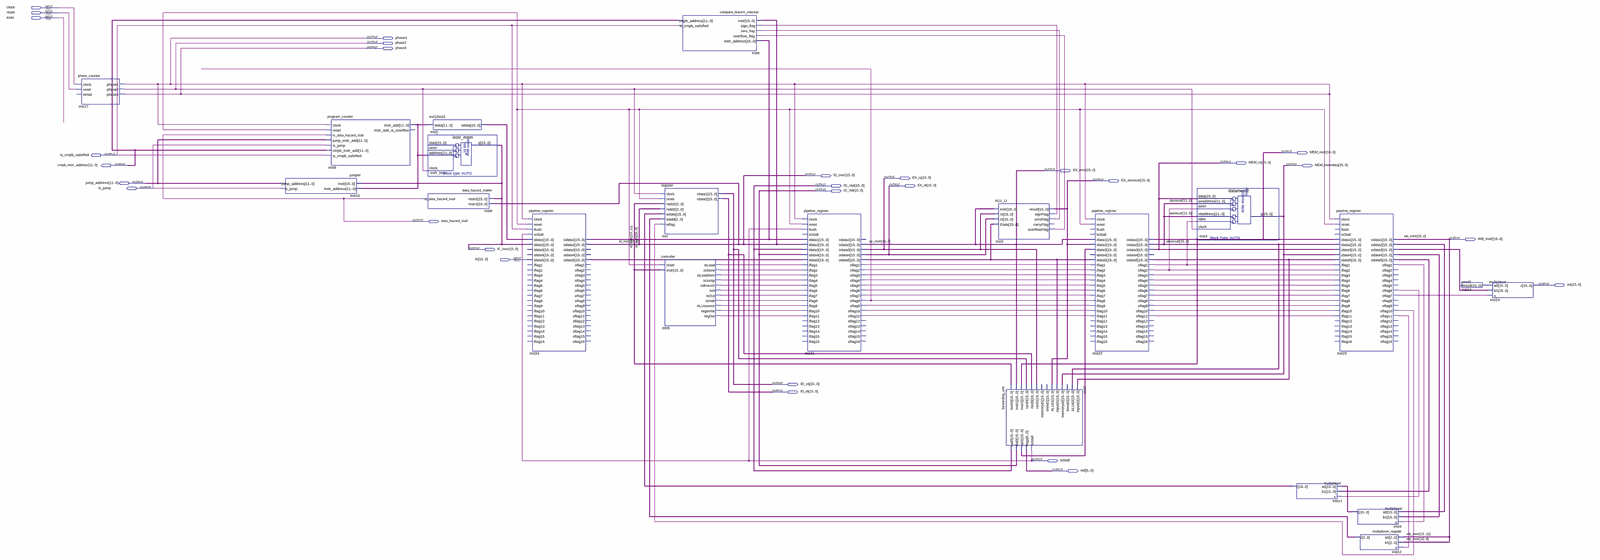
[diagram p0: schematic sheet, whole]
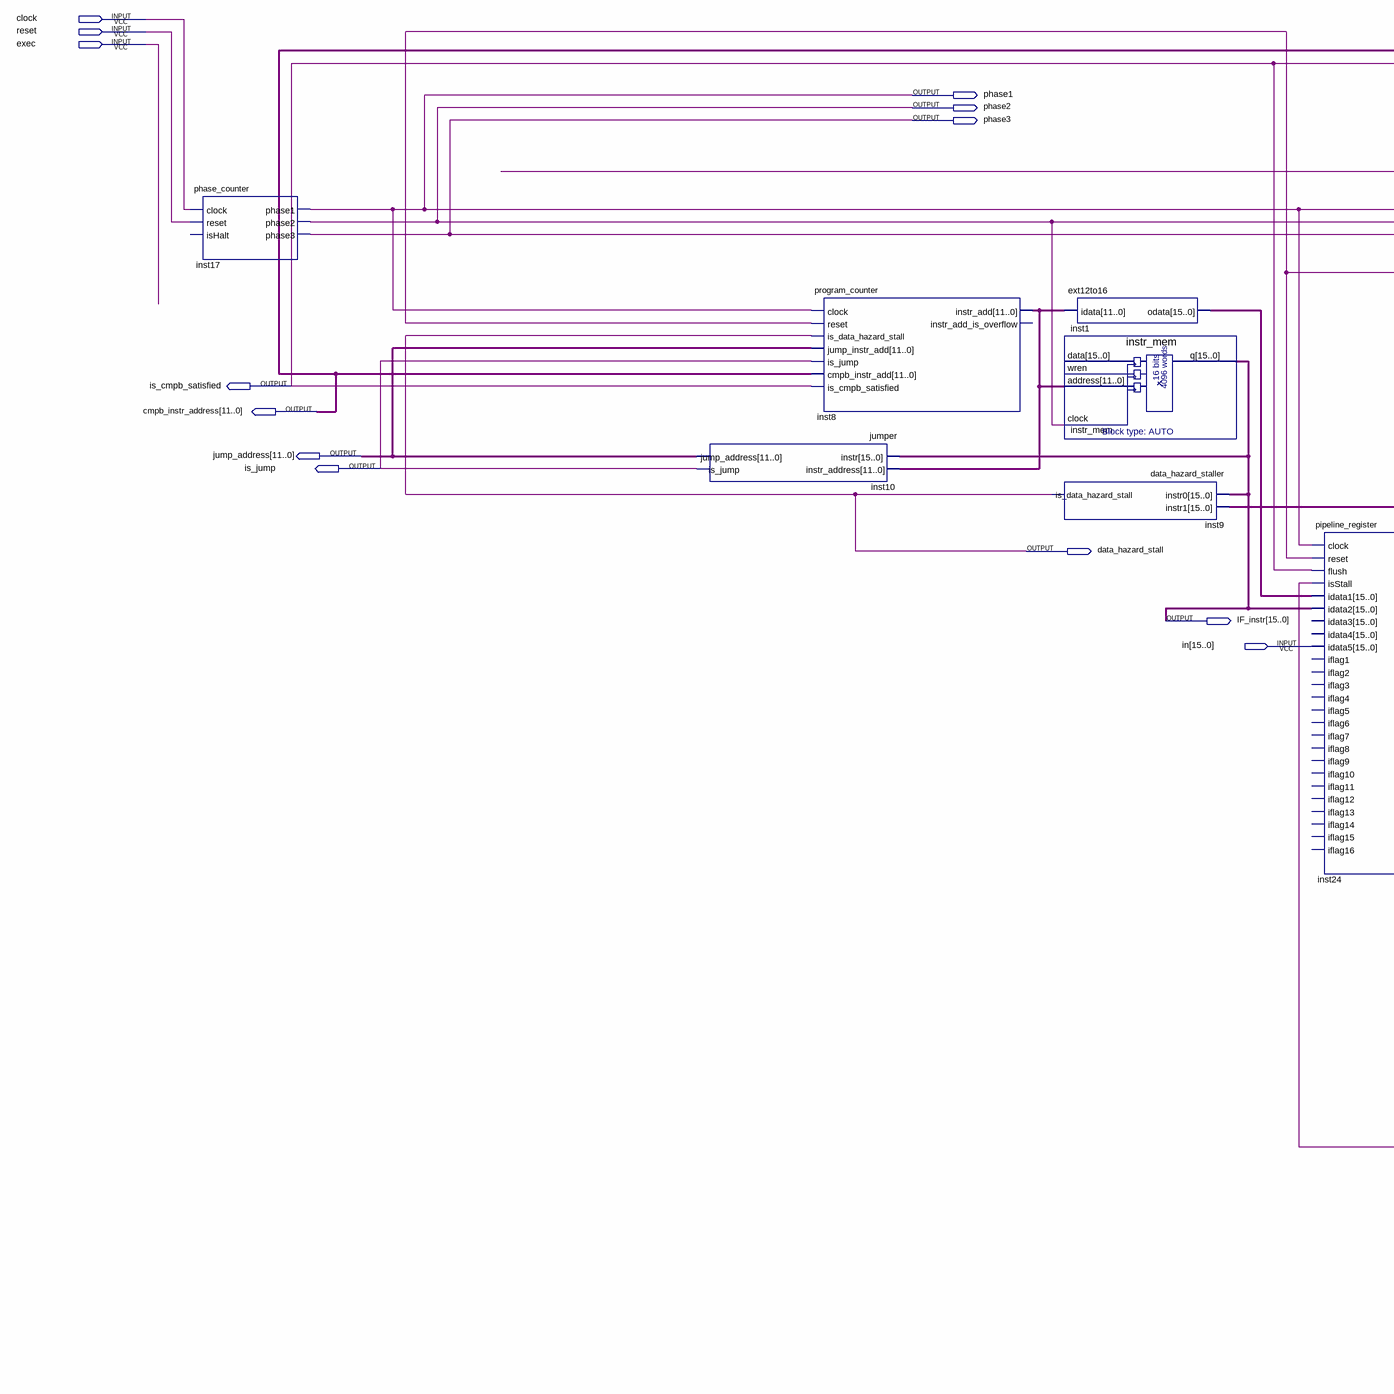
[diagram p1: schematic sheet, left part]
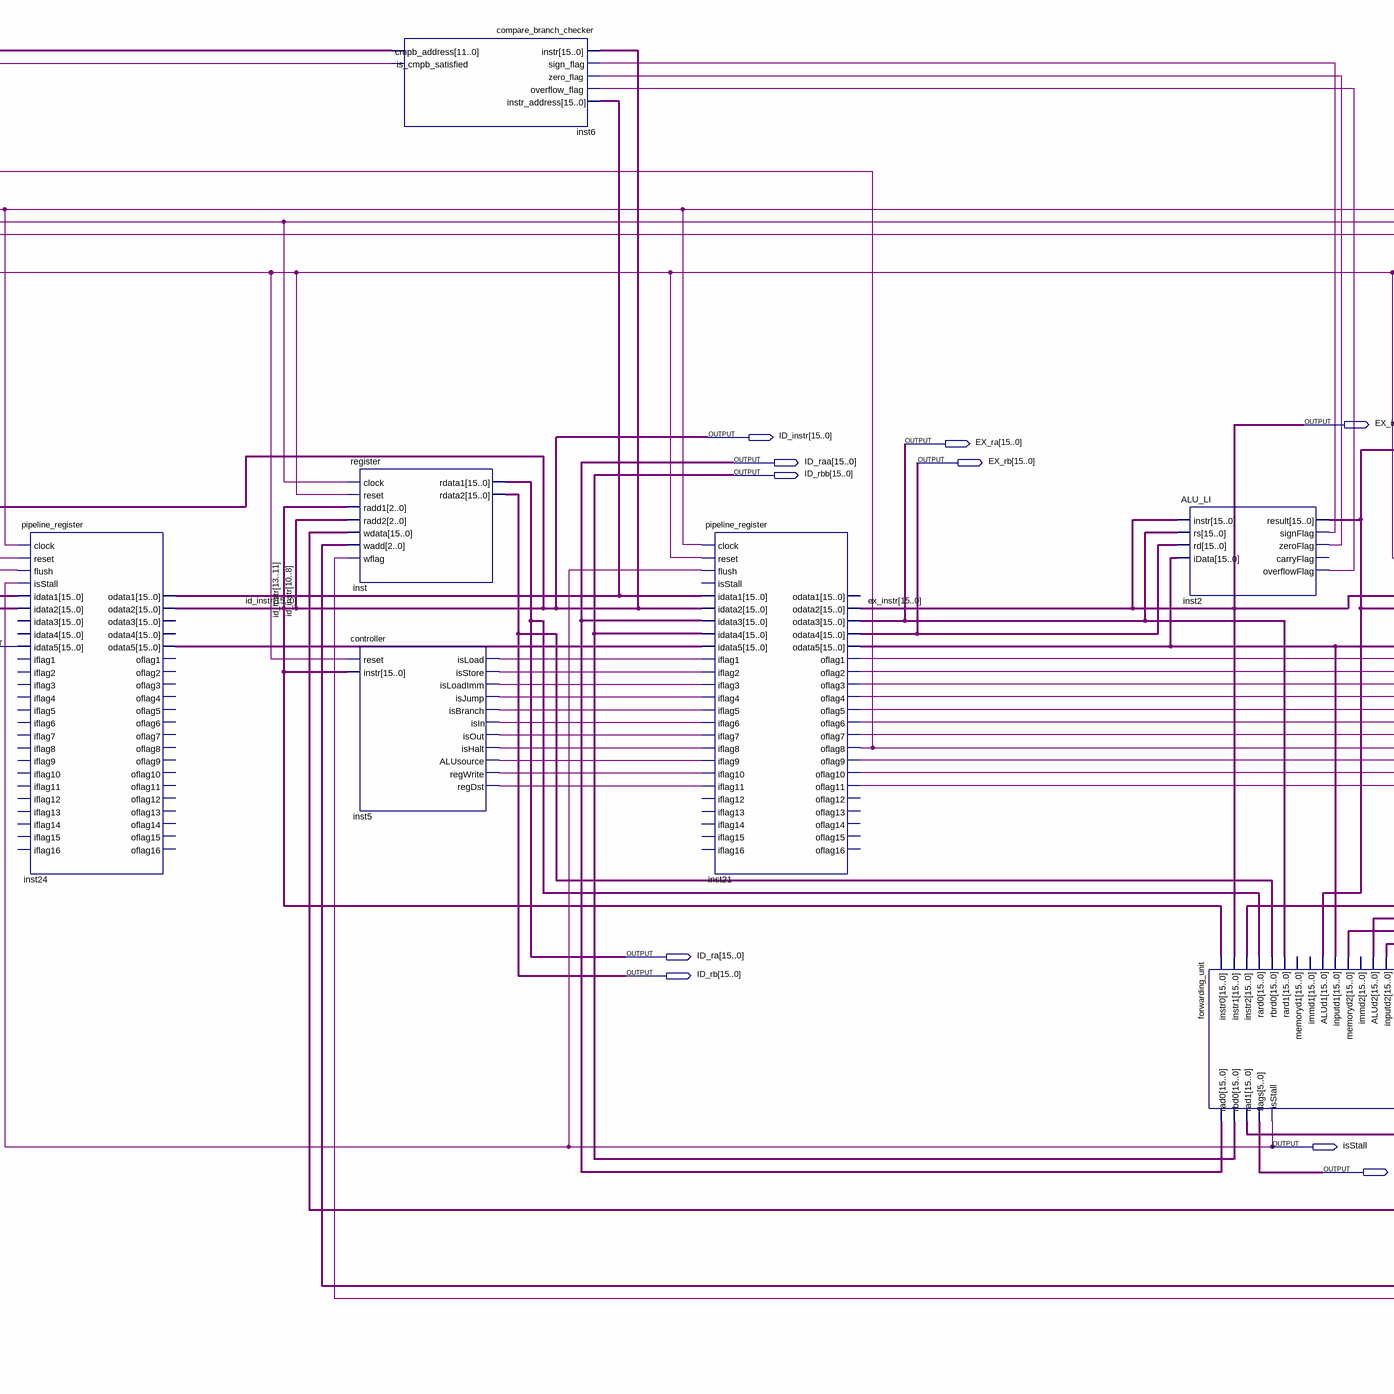
[diagram p2: schematic sheet, centre part]
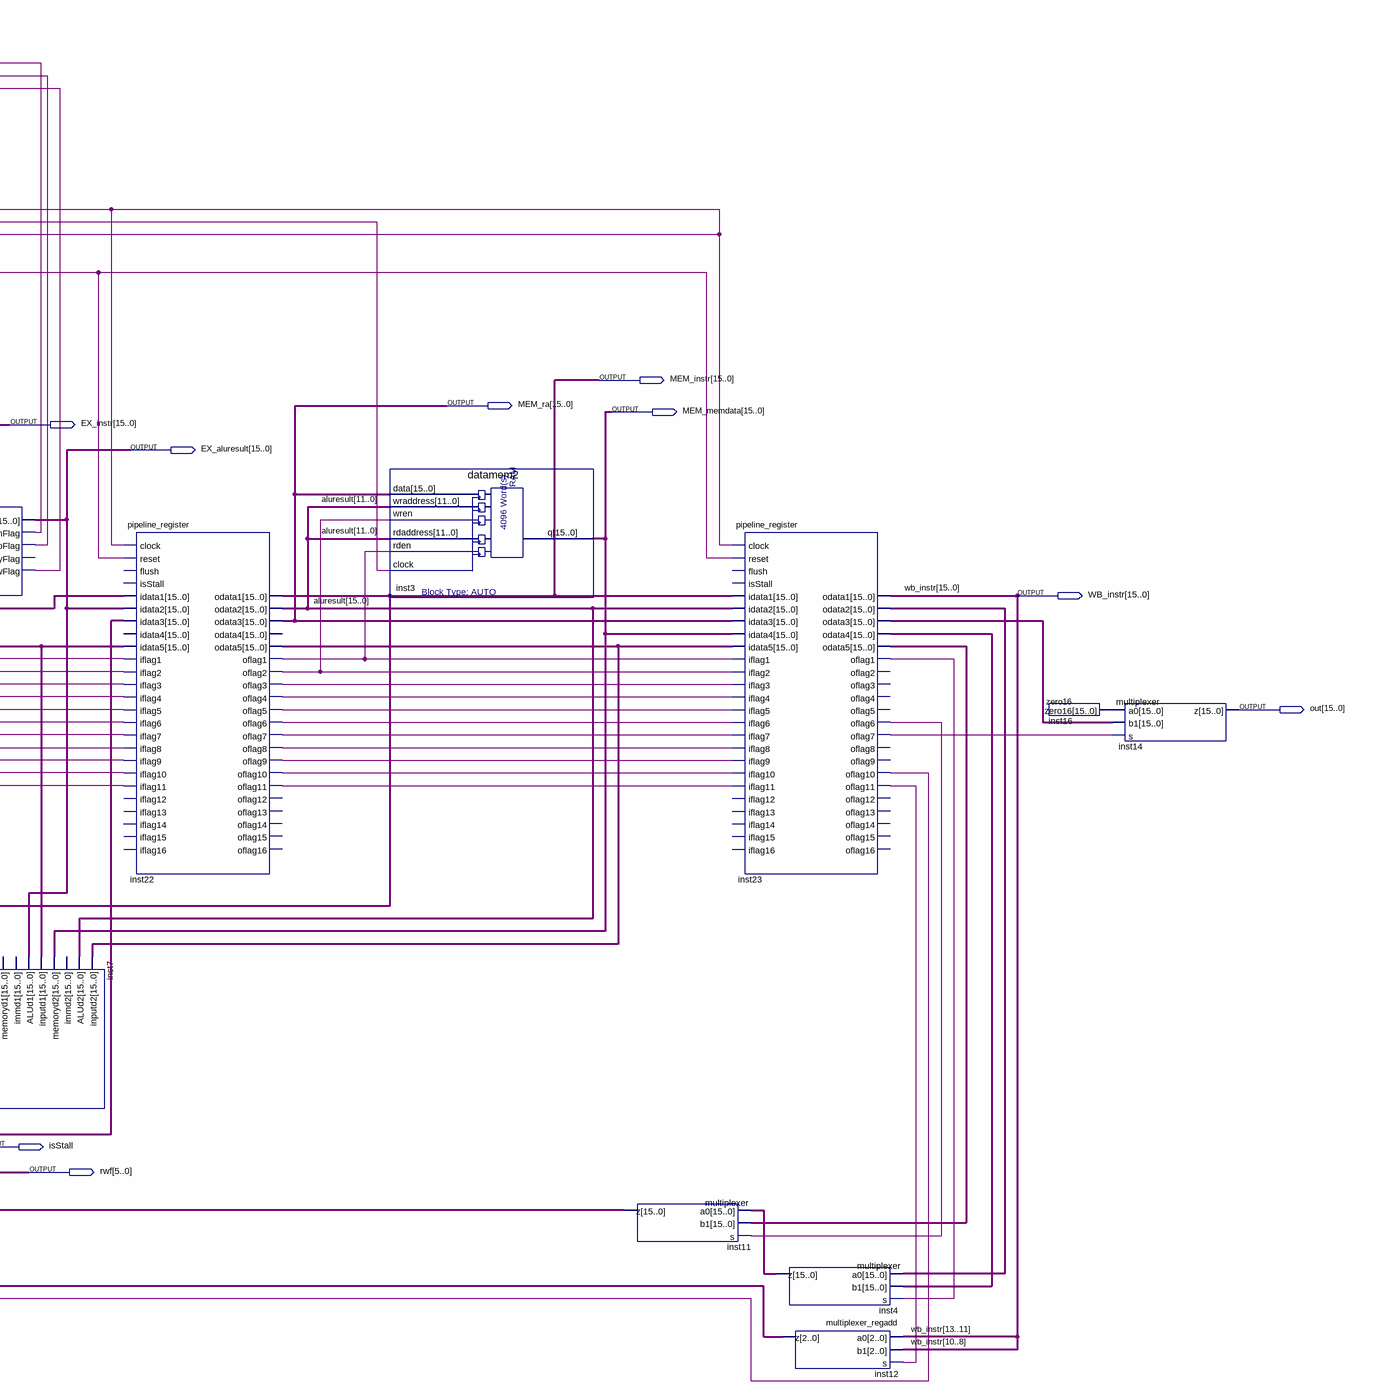
[diagram p3: schematic sheet, right part]
// Quartus schematic top514.bdf as structural Verilog: 21 symbols, 29 pins
module top514 (
  input  clock,
  input  reset,
  input  exec,
  input  [15:0] in,
  output phase1,
  output phase2,
  output phase3,
  output [15:0] MEM_instr,
  output is_cmpb_satisfied,
  output [15:0] MEM_ra,
  output [11:0] cmpb_instr_address,
  output [15:0] MEM_memdata,
  output [15:0] EX_instr,
  output [15:0] ID_instr,
  output [15:0] EX_ra,
  output [15:0] EX_aluresult,
  output [11:0] jump_address,
  output [15:0] ID_raa,
  output [15:0] EX_rb,
  output is_jump,
  output [15:0] ID_rbb,
  output data_hazard_stall,
  output [15:0] WB_instr,
  output [15:0] IF_instr,
  output [15:0] out,
  output [15:0] ID_ra,
  output [15:0] ID_rb,
  output isStall,
  output [5:0] rwf
);

  wire inst2_overflowflag, inst2_signflag, inst2_zeroflag, inst5_alusource, inst5_isbranch, inst5_ishalt,
       inst5_isin, inst5_isjump, inst5_isload, inst5_isloadimm, inst5_isout, inst5_isstore, inst5_regdst,
       inst5_regwrite, inst21_oflag1, inst21_oflag2, inst21_oflag3, inst21_oflag4, inst21_oflag5,
       inst21_oflag6, inst21_oflag7, inst21_oflag8, inst21_oflag9, inst21_oflag10, inst21_oflag11,
       inst22_oflag1, inst22_oflag2, inst22_oflag3, inst22_oflag4, inst22_oflag5, inst22_oflag6,
       inst22_oflag7, inst22_oflag8, inst22_oflag9, inst22_oflag10, inst22_oflag11, inst23_oflag1,
       inst23_oflag6, inst23_oflag7, inst23_oflag10, inst23_oflag11, undriven;
  wire [2:0] inst12_z;
  wire [11:0] inst8_instr_add;
  wire [15:0] aluresult, inst1_odata, inst4_z, inst7_rad1, inst11_z, inst16_zero16, inst21_odata5,
       inst22_odata5, inst23_odata2, inst23_odata3, inst23_odata4, inst23_odata5, inst24_odata1,
       inst24_odata5;

  phase_counter inst17 (
    .clock(clock), .reset(reset), .phase1(phase1), .phase2(phase2), .phase3(phase1));  // open: isHalt
  jumper inst10 (.instr(IF_instr), .instr_address(inst8_instr_add), .jump_address(jump_address), .is_jump(is_jump));
  program_counter inst8 (
    .clock(phase1), .reset(undriven), .is_data_hazard_stall(data_hazard_stall),
    .jump_instr_add(jump_address), .is_jump(is_jump), .cmpb_instr_add(cmpb_instr_address),
    .is_cmpb_satisfied(is_cmpb_satisfied), .instr_add(inst8_instr_add));  // open: instr_add_is_overflow
  ext12to16 inst1 (.idata(inst8_instr_add), .odata(inst1_odata));
  instr_mem instr_mem (.address(inst8_instr_add), .clock(phase2), .q(IF_instr));  // open: data, wren
  data_hazard_staller inst9 (.instr0(IF_instr), .instr1(ID_instr), .is_data_hazard_stall(data_hazard_stall));
  pipeline_register inst24 (
    .clock(phase1), .reset(undriven), .flush(is_cmpb_satisfied), .isStall(isStall), .idata1(inst1_odata),
    .idata2(IF_instr), .idata5(in), .odata1(inst24_odata1), .odata2(ID_instr), .odata5(inst24_odata5));  // open: idata3, idata4, iflag1, iflag2, iflag3, iflag4, iflag5, iflag6, iflag7, iflag8, iflag9, iflag10, iflag11, iflag12, iflag13, iflag14, iflag15, iflag16, odata3, odata4, oflag1, oflag2, oflag3, oflag4, oflag5, oflag6, oflag7, oflag8, oflag9, oflag10, oflag11, oflag12, oflag13, oflag14, oflag15, oflag16
  register inst (
    .clock(phase2), .reset(undriven), .radd1(ID_instr[13:11]), .radd2(ID_instr[10:8]), .wdata(inst11_z),
    .wadd(inst12_z), .wflag(inst23_oflag10), .rdata1(ID_ra), .rdata2(ID_rb));
  controller inst5 (
    .reset(undriven), .instr(ID_instr), .isLoad(inst5_isload), .isStore(inst5_isstore),
    .isLoadImm(inst5_isloadimm), .isJump(inst5_isjump), .isBranch(inst5_isbranch), .isIn(inst5_isin),
    .isOut(inst5_isout), .isHalt(inst5_ishalt), .ALUsource(inst5_alusource), .regWrite(inst5_regwrite),
    .regDst(inst5_regdst));
  compare_branch_checker inst6 (
    .instr(ID_instr), .sign_flag(inst2_signflag), .zero_flag(inst2_zeroflag),
    .overflow_flag(inst2_overflowflag), .instr_address(inst24_odata1), .cmpb_address(cmpb_instr_address),
    .is_cmpb_satisfied(is_cmpb_satisfied));
  pipeline_register inst21 (
    .clock(phase1), .reset(undriven), .flush(isStall), .idata1(inst24_odata1), .idata2(ID_instr),
    .idata3(ID_raa), .idata4(ID_rbb), .idata5(inst24_odata5), .iflag1(inst5_isload), .iflag2(inst5_isstore),
    .iflag3(inst5_isloadimm), .iflag4(inst5_isjump), .iflag5(inst5_isbranch), .iflag6(inst5_isin),
    .iflag7(inst5_isout), .iflag8(inst5_ishalt), .iflag9(inst5_alusource), .iflag10(inst5_regwrite),
    .iflag11(inst5_regdst), .odata2(EX_instr), .odata3(EX_ra), .odata4(EX_rb), .odata5(inst21_odata5),
    .oflag1(inst21_oflag1), .oflag2(inst21_oflag2), .oflag3(inst21_oflag3), .oflag4(inst21_oflag4),
    .oflag5(inst21_oflag5), .oflag6(inst21_oflag6), .oflag7(inst21_oflag7), .oflag8(inst21_oflag8),
    .oflag9(inst21_oflag9), .oflag10(inst21_oflag10), .oflag11(inst21_oflag11));  // open: isStall, iflag12, iflag13, iflag14, iflag15, iflag16, odata1, oflag12, oflag13, oflag14, oflag15, oflag16
  ALU_LI inst2 (
    .instr(EX_instr), .rs(EX_ra), .rd(EX_rb), .iData(inst21_odata5), .result(EX_aluresult),
    .signFlag(inst2_signflag), .zeroFlag(inst2_zeroflag), .overflowFlag(inst2_overflowflag));  // open: carryFlag
  forwarding_unit inst7 (
    .instr0(ID_instr), .instr1(EX_instr), .instr2(MEM_instr), .rard0(ID_ra), .rbrd0(ID_rb), .rard1(EX_ra),
    .ALUd1(EX_aluresult), .inputd1(inst21_odata5), .memoryd2(MEM_memdata), .ALUd2(aluresult),
    .inputd2(inst22_odata5), .rad0(ID_raa), .rbd0(ID_rbb), .rad1(inst7_rad1), .flags(rwf), .isStall(isStall));  // open: memoryd1, immd1, immd2
  pipeline_register inst22 (
    .clock(phase1), .reset(undriven), .idata1(EX_instr), .idata2(EX_aluresult), .idata3(inst7_rad1),
    .idata5(inst21_odata5), .iflag1(inst21_oflag1), .iflag2(inst21_oflag2), .iflag3(inst21_oflag3),
    .iflag4(inst21_oflag4), .iflag5(inst21_oflag5), .iflag6(inst21_oflag6), .iflag7(inst21_oflag7),
    .iflag8(inst21_oflag8), .iflag9(inst21_oflag9), .iflag10(inst21_oflag10), .iflag11(inst21_oflag11),
    .odata1(MEM_instr), .odata2(aluresult), .odata3(MEM_ra), .odata5(inst22_odata5), .oflag1(inst22_oflag1),
    .oflag2(inst22_oflag2), .oflag3(inst22_oflag3), .oflag4(inst22_oflag4), .oflag5(inst22_oflag5),
    .oflag6(inst22_oflag6), .oflag7(inst22_oflag7), .oflag8(inst22_oflag8), .oflag9(inst22_oflag9),
    .oflag10(inst22_oflag10), .oflag11(inst22_oflag11));  // open: flush, isStall, idata4, iflag12, iflag13, iflag14, iflag15, iflag16, odata4, oflag12, oflag13, oflag14, oflag15, oflag16
  datamem2 inst3 (
    .data(MEM_ra), .wraddress(aluresult[11:0]), .wren(inst22_oflag2), .rdaddress(aluresult[11:0]),
    .rden(inst22_oflag1), .clock(phase2), .q(MEM_memdata));
  multiplexer inst11 (.a0(inst4_z), .b1(inst23_odata5), .s(inst23_oflag6), .z(inst11_z));
  pipeline_register inst23 (
    .clock(phase1), .reset(undriven), .idata1(MEM_instr), .idata2(aluresult), .idata3(MEM_ra),
    .idata4(MEM_memdata), .idata5(inst22_odata5), .iflag1(inst22_oflag1), .iflag2(inst22_oflag2),
    .iflag3(inst22_oflag3), .iflag4(inst22_oflag4), .iflag5(inst22_oflag5), .iflag6(inst22_oflag6),
    .iflag7(inst22_oflag7), .iflag8(inst22_oflag8), .iflag9(inst22_oflag9), .iflag10(inst22_oflag10),
    .iflag11(inst22_oflag11), .odata1(WB_instr), .odata2(inst23_odata2), .odata3(inst23_odata3),
    .odata4(inst23_odata4), .odata5(inst23_odata5), .oflag1(inst23_oflag1), .oflag6(inst23_oflag6),
    .oflag7(inst23_oflag7), .oflag10(inst23_oflag10), .oflag11(inst23_oflag11));  // open: flush, isStall, iflag12, iflag13, iflag14, iflag15, iflag16, oflag2, oflag3, oflag4, oflag5, oflag8, oflag9, oflag12, oflag13, oflag14, oflag15, oflag16
  multiplexer inst4 (.a0(inst23_odata2), .b1(inst23_odata4), .s(inst23_oflag1), .z(inst4_z));
  multiplexer_regadd inst12 (.a0(WB_instr[13:11]), .b1(WB_instr[10:8]), .s(inst23_oflag11), .z(inst12_z));
  zero16 inst16 (.zero16(inst16_zero16));
  multiplexer inst14 (.a0(inst16_zero16), .b1(inst23_odata3), .s(inst23_oflag7), .z(out));

  assign phase3 = phase1;
endmodule
